# EAGLE design arduinoshield (EAGLE 6.2)
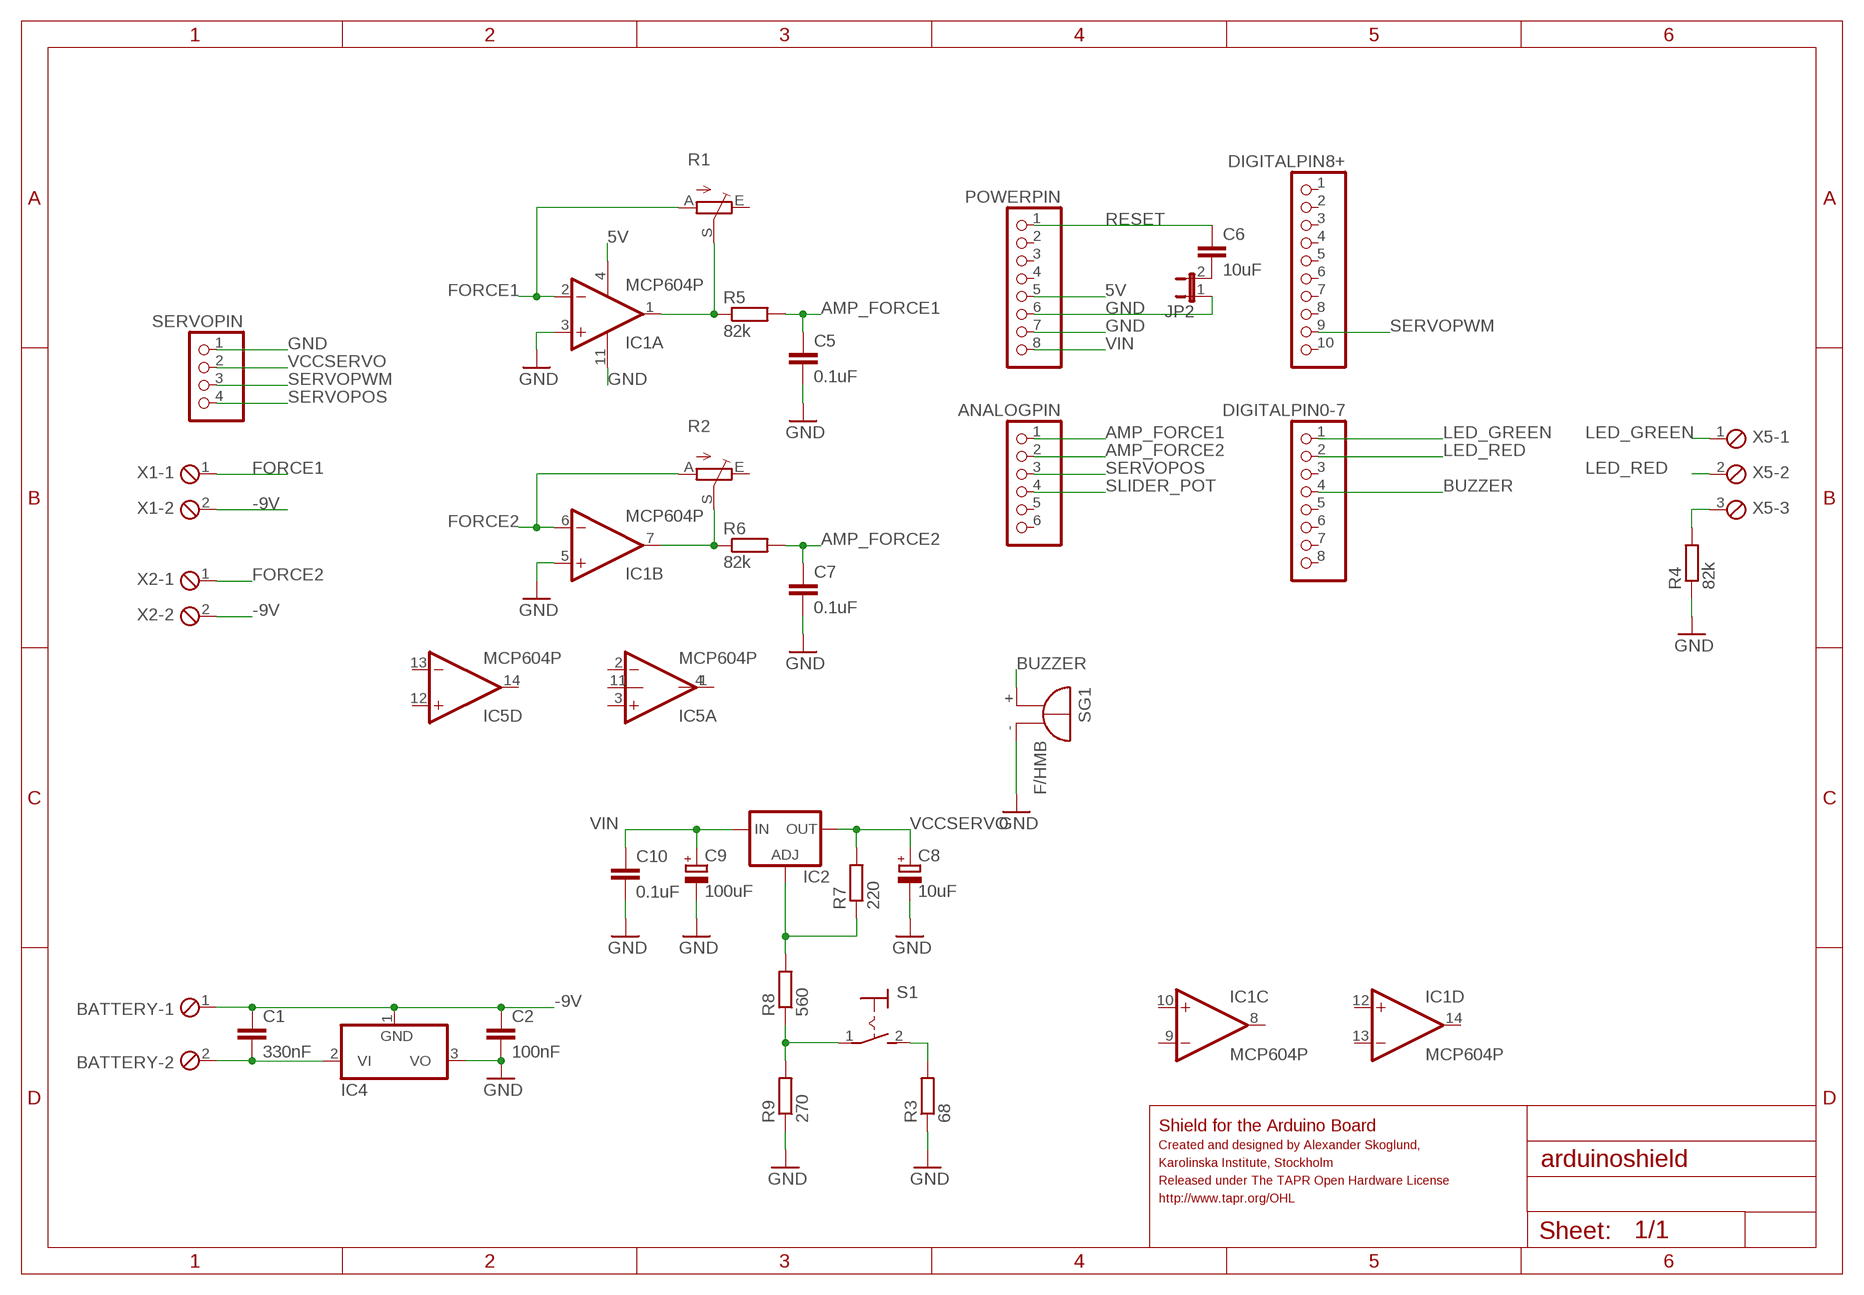
[diagram p0: schematic, sheet 1]

## Parts
ANALOGPIN  PINHD-1X6  [1X06]
BATTERY  MPT2  [2POL254]
C1  330nF  C-EU025-025X050  [C025-025X050]
C2  100nF  C-EU025-025X050  [C025-025X050]
C5  0.1uF  C-EU025-025X050  [C025-025X050]
C6  10uF  C-EU050-025X075  [C050-025X075]
C7  0.1uF  C-EU025-025X050  [C025-025X050]
C8  10uF  CPOL-EUE2.5-5  [E2,5-5]
C9  100uF  CPOL-EUE2.5-7  [E2,5-7]
C10  0.1uF  C-EU050-025X075  [C050-025X075]
DIGITALPIN0-7  PINHD-1X8  [1X08]
DIGITALPIN8+  PINHD-1X10  [1X10]
IC1  MCP604P  [DIL14]
IC2  LM317TL  [317TL]
IC4  7905T  [TO220H]
IC5  MCP604P  [DIL14]
JP2  JP1E  [JP1]
POWERPIN  PINHD-1X8  [1X08]
R1  TRIM_EU-S64W  [S64W]
R2  TRIM_EU-S64W  [S64W]
R3  68  R-EU_0207/7  [0207/7]
R4  82k  R-EU_0207/7  [0207/7]
R5  82k  R-EU_0207/7  [0207/7]
R6  82k  R-EU_0207/7  [0207/7]
R7  220  R-EU_0207/7  [0207/7]
R8  560  R-EU_0207/7  [0207/7]
R9  270  R-EU_0207/7  [0207/7]
S1  MS243  [MS243]
SERVOPIN  PINHD-1X4  [1X04]
SG1  F/HMB  [F/HMB]
X1  MPT2  [2POL254]
X2  MPT2  [2POL254]
X5  MPT3  [3POL254]

## Nets
5V: IC1.4(P:V+) POWERPIN.5
-9V: BATTERY.1 C1.1 C2.1 IC4.1(GND) X1.2 X2.2
AMP_FORCE1: ANALOGPIN.1 C5.1 R5.2
AMP_FORCE2: ANALOGPIN.2 C7.1 R6.2
BUZZER: DIGITALPIN0-7.4 SG1.+
FORCE1: IC1.2(A:-IN) R1.A X1.1
FORCE2: IC1.6(B:-IN) R2.A X2.1
GND: C2.2 C5.2 C7.2 C8.- C9.- C10.2 IC1.3(A:+IN) IC1.5(B:+IN) IC1.11(P:V-) IC4.3(VO) JP2.1 POWERPIN.6 POWERPIN.7 R3.1 R4.1 R9.1 SERVOPIN.1 SG1.-
LED_GREEN: DIGITALPIN0-7.1 X5.1
LED_RED: DIGITALPIN0-7.2 X5.2
N$1: R4.2
N$2: BATTERY.2 C1.2 IC4.2(VI)
N$3: C6.2 JP2.2
N$4: R3.2 S1.2(S)
N$5: IC5.1(A:OUT) IC5.4(P:V+)
N$12: IC1.1(A:OUT) R1.S R5.1
N$13: IC1.7(B:OUT) R2.S R6.1
N$19: R8.1 R9.2 S1.1(P)
N$23: IC2.1(ADJ) R7.1 R8.2
RESET: C6.1 POWERPIN.1
SERVOPOS: ANALOGPIN.3 SERVOPIN.4
SERVOPWM: DIGITALPIN8+.9 SERVOPIN.3
SLIDER_POT: ANALOGPIN.4
VCCSERVO: C8.+ IC2.2(OUT) R7.2 SERVOPIN.2
VIN: C9.+ C10.1 IC2.3(IN) POWERPIN.8
Unconnected: ANALOGPIN.5 ANALOGPIN.6 DIGITALPIN0-7.3 DIGITALPIN0-7.5 DIGITALPIN0-7.6 DIGITALPIN0-7.7 DIGITALPIN0-7.8 DIGITALPIN8+.1 DIGITALPIN8+.2 DIGITALPIN8+.3 DIGITALPIN8+.4 DIGITALPIN8+.5 DIGITALPIN8+.6 DIGITALPIN8+.7 DIGITALPIN8+.8 DIGITALPIN8+.10 IC1.8(C:OUT) IC1.9(C:-IN) IC1.10(C:+IN) IC1.12(D:+IN) IC1.13(D:-IN) IC1.14(D:OUT) IC5.2(A:-IN) IC5.3(A:+IN) IC5.5(B:+IN) IC5.6(B:-IN) IC5.7(B:OUT) IC5.8(C:OUT) IC5.9(C:-IN) IC5.10(C:+IN) IC5.12(D:+IN) IC5.13(D:-IN) IC5.14(D:OUT) POWERPIN.2 POWERPIN.3 POWERPIN.4 R1.E R2.E X5.3

## Notes on the sheet
- Shield for the Arduino Board
- Created and designed by Alexander Skoglund,
- Karolinska Institute, Stockholm
- Released under The TAPR Open Hardware License
- http://www.tapr.org/OHL

## Power pins joined to a net without a drawn wire
V-: IC5.11(P:V-)

## Library data of the parts
ANALOGPIN = pinhead:PINHD-1X6: PIN HEADER
BATTERY X1 X2 = con-phoenix-254:MPT2: PHOENIX CONNECTOR; OC_FARNELL: unknown; OC_NEWARK: unknown
C1 C2 = rcl:C-EU: CAPACITOR, European symbol
C5-C7 C10 = resistor:C-EU: CAPACITOR, European symbol
C8 C9 = resistor:CPOL-EU: POLARIZED CAPACITOR, European symbol
DIGITALPIN0-7 POWERPIN = pinhead:PINHD-1X8: PIN HEADER
DIGITALPIN8+ = pinhead:PINHD-1X10: PIN HEADER
IC1 IC5 = linear:MCP604: Quad Op Amp 2.7V to 6.0V Single Supply CMOS Source: http://ww1.microchip.com/downloads/en/DeviceDoc/21314g.pdf
IC2 = v-reg:LM317TL: VOLTAGE REGULATOR
IC4 = linear:79*: Negative VOLTAGE REGULATOR
JP2 = jumper:JP1E: JUMPER
R1 R2 = pot:TRIM_EU-: POTENTIOMETER
R3-R9 = resistor:R-EU_: RESISTOR, European symbol
S1 = switch:MS243: TOGGLE SWITCH
SERVOPIN = pinhead:PINHD-1X4: PIN HEADER
SG1 = buzzer:F/HMB: BUZZER Source: Buerklin; OC_FARNELL: unknown; OC_NEWARK: unknown
X5 = con-phoenix-254:MPT3: PHOENIX CONNECTOR; OC_FARNELL: unknown; OC_NEWARK: unknown

## Board
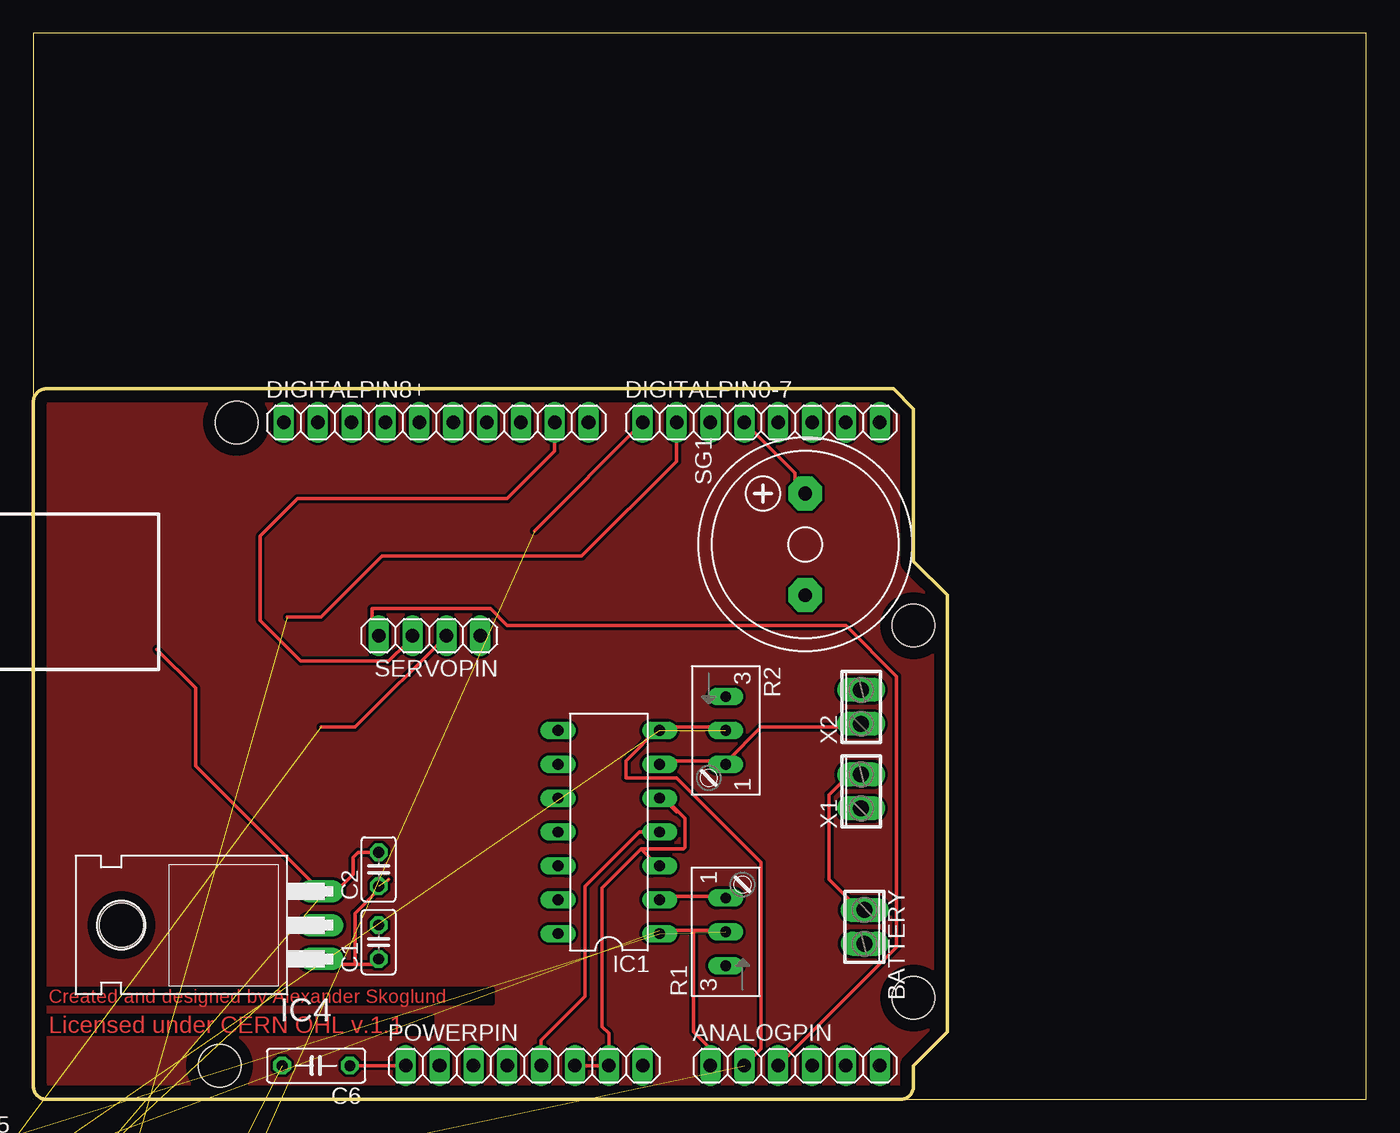
[diagram p1: board, top side]
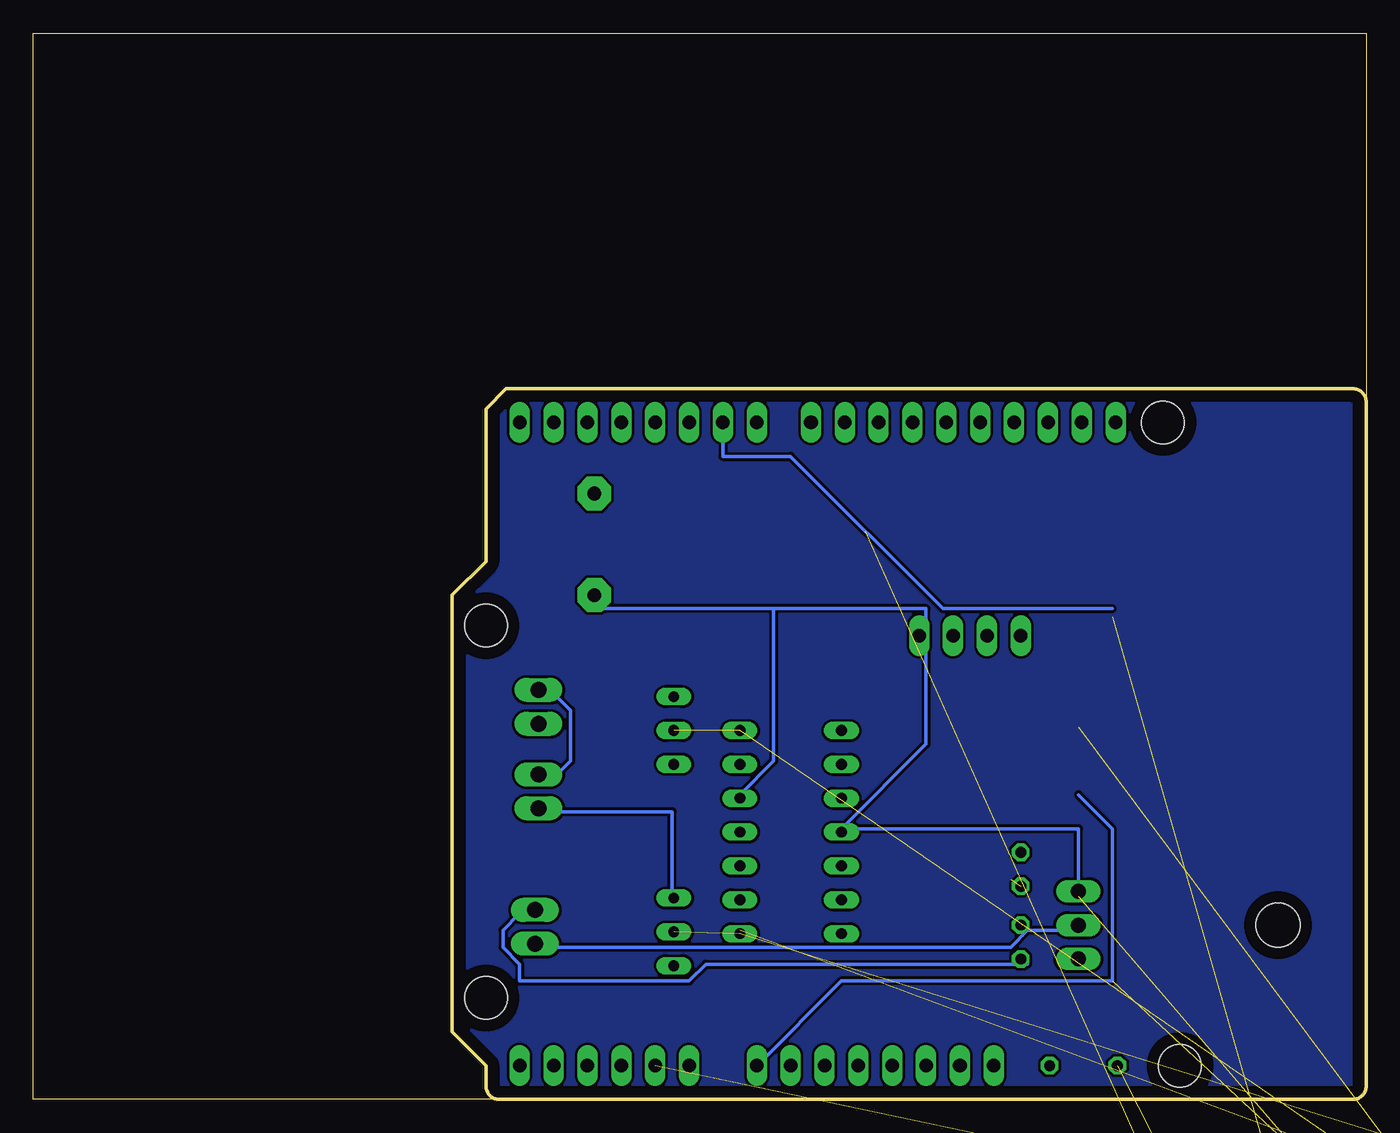
[diagram p2: board, bottom side, seen from below]

Size 100 x 80 mm. Coordinates in mm from the lower left corner, seen from the top.
Outline: 65.04,0 100,0 100,80 0,80 0,52.34
Outline: 0,52.34 0,52.32
Outline: 0,1.02 0,1
Outline: 0,1 arc90 1,0 65.04,0
Outline: 0,1 0,52.34
Outline: 0,52.34 arc-90 1,53.34 64.52,53.34 66.04,51.82 66.04,40.39 68.58,37.85 68.58,5.08 66.04,2.54 66.04,1 arc-90 65.04,0
Copper layers (1*16): Top 0.035mm / dielectric 1.5mm / Bottom 0.035mm
Design rules: minimum track width 10mil, minimum drill 24mil, track to track 8mil, track to pad 8mil, pad to pad 8mil, via to via 8mil, smd to smd 8mil, copper to edge 35mil, drill to drill 8mil, minimum pad ring 10mil, minimum via ring 8mil, stop-mask expansion 4mil, vias tented up to drill 0mil, thermal gap 10mil
Holes 3.2 mm at 13.97,2.54 15.24,50.8 66.04,35.56 66.04,7.62

### Footprints (pad centres in the part's own frame; a part is rotated, then mirrored left to right if it is on the bottom)
1X06 = drill 1.016 long: 1 -6.35,0; 2 -3.81,0; 3 -1.27,0; 4 1.27,0; 5 3.81,0; 6 6.35,0
2POL254 = drill 1.2 long: 1 -1.27,0; 2 1.27,0
C025-025X050 = drill 0.813 octagon: 1 -1.27,0; 2 1.27,0
C050-025X075 = drill 0.813 octagon: 1 -2.54,0; 2 2.54,0
E2,5-5 = drill 0.813 pad 1.6: + -1.27,0 | drill 0.813 pad 1.6 octagon: - 1.27,0
E2,5-7 = drill 0.813 pad 1.6: + -1.27,0 | drill 0.813 pad 1.6 octagon: - 1.27,0
1X08 = drill 1.016 long: 1 -8.89,0; 2 -6.35,0; 3 -3.81,0; 4 -1.27,0; 5 1.27,0; 6 3.81,0; 7 6.35,0; 8 8.89,0
1X10 = drill 1.016 long: 1 -11.43,0; 2 -8.89,0; 3 -6.35,0; 4 -3.81,0; 5 -1.27,0; 6 1.27,0; 7 3.81,0; 8 6.35,0; 9 8.89,0; 10 11.43,0
DIL14 = drill 0.813 long: 1 -7.62,-3.81; 2 -5.08,-3.81; 3 -2.54,-3.81; 4 0,-3.81; 5 2.54,-3.81; 6 5.08,-3.81; 7 7.62,-3.81; 8 7.62,3.81; 9 5.08,3.81; 10 2.54,3.81; 11 0,3.81; 12 -2.54,3.81; 13 -5.08,3.81; 14 -7.62,3.81
317TL = drill 1.016 long: 1 -2.54,-3.81; 2 0,-3.81; 3 2.54,-3.81 | hole 3.302: 0,11.176
TO220H = drill 1.118 long: 1 -2.54,-10.16; 2 0,-10.16; 3 2.54,-10.16 | hole 3.302: 0,4.826
JP1 = drill 0.914 long: 1 0,-1.27; 2 0,1.27
S64W = drill 0.813 long: A 2.54,1.27; E -2.54,1.27; S 0,1.27
0207/7 = drill 0.813 octagon: 1 -3.81,0; 2 3.81,0
MS243 = drill 1.803 pad 2 long: 1 0,-1.346; 2 0,1.346
1X04 = drill 1.016 long: 1 -3.81,0; 2 -1.27,0; 3 1.27,0; 4 3.81,0
F/HMB = drill 1.016 pad 2.54 octagon: + 3.81,0; - -3.81,0
3POL254 = drill 1.2 long: 1 -2.54,0; 2 0,0; 3 2.54,0

### Placement (x,y rotation side)
ANALOGPIN  57.15,2.54 0 top
BATTERY  62.36,12.95 270 top
C1  25.91,11.81 90 top
C2  25.91,17.27 90 top
C5  -3.68,-12.7 0 top  (outside the outline)
C6  21.21,2.54 180 top
C7  -3.68,-17.27 0 top  (outside the outline)
C8  -15.62,-23.62 0 top  (outside the outline)
C9  -14.73,-30.35 0 top  (outside the outline)
C10  -14.22,-37.47 0 top  (outside the outline)
DIGITALPIN0-7  54.61,50.8 0 top
DIGITALPIN8+  30.23,50.8 0 top
IC1  43.18,20.07 90 top
IC2  -12.95,-14.61 0 top  (outside the outline)
IC4  11.43,13.08 90 top
IC5  -7.24,-59.69 0 top  (outside the outline)
JP2  -28.57,-92.08 0 top  (outside the outline)
POWERPIN  36.83,2.54 0 top
R1  53.21,12.57 90 top
R2  50.67,27.69 270 top
R3  -13.34,-93.98 0 top  (outside the outline)
R4  -13.34,-73.03 0 top  (outside the outline)
R5  -1.52,-3.94 0 top  (outside the outline)
R6  -1.52,-8.26 0 top  (outside the outline)
R7  -13.34,-43.94 0 top  (outside the outline)
R8  -13.34,-48.26 0 top  (outside the outline)
R9  -13.34,-52.58 0 top  (outside the outline)
S1  -14.61,-85.47 0 top  (outside the outline)
SERVOPIN  29.72,34.8 180 top
SG1  57.91,41.66 90 top
X1  62.1,23.11 90 top
X2  62.1,29.46 90 top
X5  -13.59,-77.72 0 top  (outside the outline)

### Tracks (layer width: path | path; a pad name or v marks a point on that pad's centre or on a via)
5V
  Top 0.254: IC1.4 45.47,20.07 41.4,16 41.4,7.75 38.1,4.45 POWERPIN.5
-9V  (1 unrouted)
  Top 0.254: 24.13,10.16 21.59,10.16 IC4.1 | 24.13,10.16 25.4,10.16 C1.1 | BATTERY.1 62.23,13.97 59.69,16.51 59.69,22.86 60.96,24.13 X1.2 | 24.13,10.16 24.13,13.97 26.67,16.51
  Bottom 0.254: X1.2 60.96,24.13 59.69,25.4 59.69,29.21 60.96,30.48 X2.2 | C1.1 25.4,10.16 49.53,10.16 50.8,8.89 63.5,8.89 63.5,10.16 64.77,11.43 64.77,12.7 63.5,13.97 BATTERY.1
AMP_FORCE1  (2 unrouted)
  Top 0.254: 50.8,12.7 49.53,12.7 | 49.53,12.7 46.99,12.7 | 49.53,12.7 49.53,5.08 50.8,3.81 ANALOGPIN.1
AMP_FORCE2  (2 unrouted)
  Top 0.254: 50.8,27.94 46.99,27.94 44.45,25.4 44.45,24.13 48.26,24.13 54.61,17.78 54.61,3.81 ANALOGPIN.2
BUZZER
  Top 0.254: DIGITALPIN0-7.4 57.15,46.99 57.15,45.72 SG1.+
FORCE1
  Top 0.254: IC1.2 46.99,15.24 50.8,15.24 R1.A
  Bottom 0.254: X1.1 60.96,21.59 52.07,21.59 52.07,15.24 R1.A
FORCE2
  Top 0.254: IC1.6 46.99,25.4 50.8,25.4 R2.A 52.07,25.4 54.61,27.94 60.96,27.94 X2.1
GND  (9 unrouted)
  Top 0.254: POWERPIN.6 POWERPIN.7 43.18,4.95 42.67,5.46 42.67,15.88 45.59,18.8 | 46.86,22.61 IC1.5 | IC1.5 47.37,22.61 48.32,21.65 | 48.32,21.65 48.9,21.08 48.9,18.92 48.77,18.8 45.59,18.8 | IC1.3 46.86,17.53 45.59,18.8 | IC1.11 39.37,20.19 | 9.27,33.78 12.19,30.86 12.19,25.02 IC4.3 22.73,15.62 24,16.89 24,18.16 24.38,18.54 C2.2 | IC1.5 46.99,22.86 48.26,21.59 48.32,21.65
  Bottom 0.254: 44.45,36.83 33.02,36.83 33.02,35.56 SERVOPIN.1 33.02,34.29 33.02,26.67 39.37,20.32 | 44.45,36.83 57.15,36.83 SG1.- | 44.45,36.83 44.45,25.4 46.99,22.86 IC1.5 | 39.37,20.32 21.59,20.32 IC4.3 21.59,15.24 | 39.37,20.32 IC1.11
LED_GREEN  (1 unrouted)
  Top 0.254: 37.59,42.67 DIGITALPIN0-7.1
LED_RED  (1 unrouted)
  Top 0.254: DIGITALPIN0-7.2 48.26,47.88 41.15,40.77 26.16,40.77 21.59,36.2 19.05,36.2
  Bottom 0.254: 19.05,36.83 31.75,36.83 43.18,48.26 48.26,48.26 DIGITALPIN0-7.2
N$2
  Bottom 0.254: 25.4,12.7 21.59,12.7 IC4.2 | 25.4,12.7 26.67,11.43 62.23,11.43 BATTERY.2 | 25.4,12.7 C1.2
N$3  (1 unrouted)
N$4  (1 unrouted)
N$5  (1 unrouted)
N$8
  pour Top: 1.25,0.25 arc-90 0.25,1.25 0.25,52.09 arc-90 1.25,53.09 64.26,53.09 65.79,51.56 65.79,40.13 68.33,37.59 68.33,5.33 65.79,2.79 65.79,1.25 arc-90 64.79,0.25
N$9
  pour Bottom: 1.25,0.25 arc-90 0.25,1.25 0.25,52.09 arc-90 1.25,53.09 64.26,53.09 65.79,51.56 65.79,40.13 68.33,37.59 68.33,5.33 65.79,2.79 65.79,1.25 arc-90 64.79,0.25
N$11
  Top 0: 0,0 arc10 0,0 | 0,0 arc19 0,0 | 0,0 arc19 0,0 | 0,0 arc19 0,0 | 0,0 arc19 0,0 | 0,0 arc19 0,0 | 0,0 arc19 0,0 arc-19 0,0 | 0,0 arc10 0,0 | 0,0 arc-67 0,0 | 0,0 arc-248 0,0 | 0,0 arc10 0,0 | 0,0 | 0,0 arc19 0,0 | 0,0 | 0,0 | 0,0 | 0,0 arc19 0,0 | 0,0 | 0,0 arc19 0,0 | 0,0 | 0,0 | 0,0 | 0,0 arc19 0,0 | 0,0 | 0,0 arc19 0,0 | 0,0 | 0,0 | 0,0 | 0,0 | 0,0 arc10 0,0 | 0,0 | 0,0 arc-67 0,0 | 0,0 arc-248 0,0 | 0,0
N$12  (2 unrouted)
N$13  (2 unrouted)
N$19  (2 unrouted)
N$23  (2 unrouted)
RESET
  Top 0.254: POWERPIN.1 C6.1
SERVOPOS
  Top 0.254: ANALOGPIN.3 64.77,11.43 64.77,31.75 60.96,35.56 35.56,35.56 34.29,36.83 25.4,36.83 25.4,35.56 SERVOPIN.4
SERVOPWM
  Top 0.254: 28.45,34.67 28,34.23 | 28,34.23 26.67,32.89 20.07,32.89 17.02,35.94 17.02,42.29 19.81,45.09 35.56,45.09 39.12,48.64 DIGITALPIN8+.9 | SERVOPIN.3 27.94,34.29 28,34.23
VCCSERVO  (3 unrouted)
  Top 0.254: SERVOPIN.2 24.13,27.94 21.59,27.94
VIN  (3 unrouted)
  Bottom 0.254: POWERPIN.8 39.37,8.89 19.05,8.89 19.05,20.32 21.59,22.86

### Text on the board
Top: Created and designed by Alexander Skoglund | Licensed under CERN OHL v.1.1